# Altium project Fujin_Encoder.PrjPcb
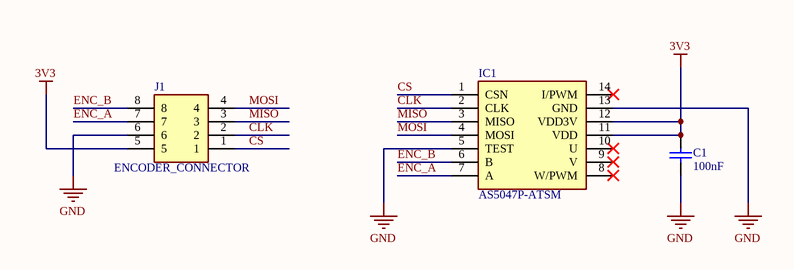
[diagram p0: Fujin_Encoder.SchDoc]
1 sheet, 3 parts. Net scope: global (net labels, ports and power ports of the same name join across sheets).
Board file: Fujin_Encoder.PcbDoc

## Sheet Fujin_Encoder.SchDoc
size A4; SheetNumber: 1; SheetTotal: 1

### Parts
C1  100nF  [Capacitor-0603]
IC1  AS5047P-ATSM  [SOP65P640X120-14N]
J1  ENCODER_CONNECTOR  [ENCODER_CONN]

### Nets
3V3: C1.2 IC1.11(VDD) IC1.12(VDD3V) J1.5
GND: C1.1 IC1.5(TEST) IC1.13(GND) J1.6
CLK: IC1.2(CLK) J1.2
CS: IC1.1(CSN) J1.1
ENC_A: IC1.7(A) J1.7
ENC_B: IC1.6(B) J1.8
MISO: IC1.3(MISO) J1.3
MOSI: IC1.4(MOSI) J1.4

Not connected (* = marked no-connect by the designer): IC1 8(W/PWM)* 9(V)* 10(U)* 14(I/PWM)*

### Library data of the parts
C1 = CAP 100NF 50V: Capacitor Cer 100nF 50V; Manufacturer Part Number: IMP14925; Product Range: MCFY Series; Capacitance: 0.1uF; Capacitance Tolerance: +80%, -20%; Dielectric Characteristic: Y5; Voltage Rating: 50; Capacitor Terminals: Radial Leaded; SVHC: No SVHC (15-Jun-2015); Supplier 1: Mult Comercial; Manufacturer: -; RoHS: YES; Stock 1: 115809; Pricing 1: 1=0.10 (BRL); Packaging: Each; Lead Spacing: 5; Operating Temperature Min: -25; Operating Temperature Max: 85; Capacitance Tolerance ±: +80%, -20%; Operating Temperature Range: -25°C to +85°C<!--FANDB--><div class="features-and-benefits-container"><div class="features-and-benefits-description"><span class="features-benefits-value">The MCFY series from Multicomp are radial leaded ceramic disc capacitors. The capacitance values ranges from 6800pF to 0.22?F.</span></div><div class="features-and-benefits-list"><ul class="features-and-benefits-list-list"><li class="features-and-benefits-list-item">Large capacitance in small size</li><li class="features-and-benefits-list-item">Rated voltage of 50V</li><li class="features-and-benefits-list-item">80%/-20% tolerance</li><li class="features-and-benefits-list-item">Operating temperature range -25°C to +85; ComponentLink1URL: http://loja.multcomercial.com.br/capacitor-ceramico-disco-100kpf-50v-104-100k-100nf-0-1uf-cod-1351.html; ComponentLink1Description: http://loja.multcomercial.com.br/capacitor-ceramico-disco-100kpf-50v-104-100k-100nf-0-1uf-cod-1351.html; Supplier Part Number 1: Capacitor Cerâmico Disco 100Kpf/50V (104/100K/100nF/0.1uF) cód. 1351
IC1 = AS5047P-ATSM: Integrated Circuit; Manufacturer_Name: ams OSRAM; Datasheet Link: https://datasheet.datasheetarchive.com/originals/distributors/DKDS-7/120640.pdf; Height: 1.2mm; Manufacturer_Part_Number: AS5047P-ATSM; Mouser Part Number: 985-AS5047P-ATSM; Mouser Price/Stock: https://www.mouser.co.uk/ProductDetail/ams-OSRAM/AS5047P-ATSM?qs=cGEy3R83DS8fzNOVLHtOgg%3D%3D; Arrow Part Number: AS5047P-ATSM; Arrow Price/Stock: https://www.arrow.com/en/products/as5047p-atsm/ams-osram?region=nac